# Altium schematic sheet Power.SchDoc
size A; DocumentNumber: 2; SheetNumber: 2; SheetTotal: 5
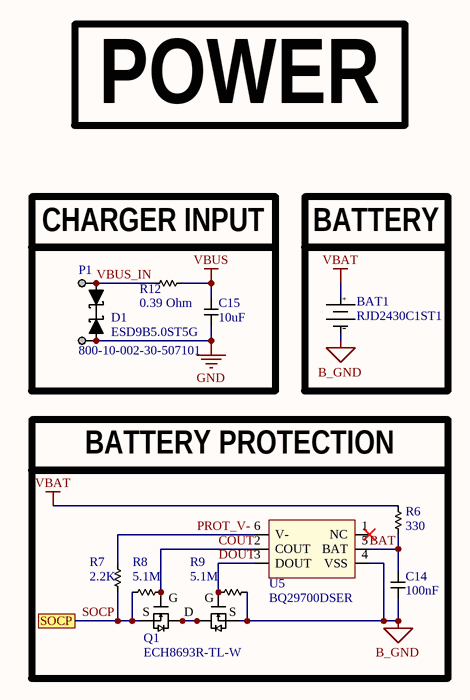
[diagram p0: Power.SchDoc]

## Parts
BAT1  RJD2430C1ST1  [RJD2430C1ST1]
C14  100nF  [CAP_0603_HIGH]
C15  10uF  [CAP_0603_HIGH]
D1  ESD9B5.0ST5G  [ESD9B5.0ST5G]
P1  800-10-002-30-507101  [800-10-002-30-507101]
Q1  ECH8693R-TL-W  [ECH8693R-TL-W]
R6  330  [RES_0603_HIGH]
R7  2.2K  [RES_0603_HIGH]
R8  5.1M  [RES_0603_HIGH]
R9  5.1M  [RES_0603_HIGH]
R12  0.39 Ohm  [RES_0805_HIGH]
U5  BQ29700DSER  [BQ29700DSER]

## Blocks framed on the sheet
CHARGER INPUT: C15 D1 P1 R12
BATTERY: BAT1
BATTERY PROTECTION: C14 Q1 R6-R9 U5

## Ports
SOCP

## Nets
B_GND: BAT1.2(-) C14.2 Q1.3(S2) R9.1 U5.4(VSS)
GND: C15.2 D1.1 P1.2
VBAT: BAT1.1(+) R6.1
VBUS: C15.1 R12.2
BAT: C14.1 R6.2 U5.5(BAT)
COUT: Q1.2(G1) R8.1 U5.2(COUT)
DOUT: Q1.4(G2) R9.2 U5.3(DOUT)
PROT_V-: R7.1 U5.6(V-)
SOCP: Q1.1(S1) R7.2 R8.2 ; port SOCP
VBUS_IN: D1.2 P1.1 R12.1
NetQ1_5: Q1.5(D) Q1.6(D) Q1.7(D) Q1.8(D)

Not connected (* = marked no-connect by the designer): U5 1(NC)*

## Notes on the sheet
- POWER
- (in symbol ECH8693R-TL-W) G; S

## Library data of the parts
BAT1 = RJD2430C1ST1: Coin, 24.5mm 3.7V Lithium-Ion Battery Rechargeable (Secondary) 110mAh
C14 C15 = Capacitor_0603: 0603 Capacitor
D1 = ESD9B5.0ST5G: TVS DIODE 5V SOD923
P1 = 800-10-002-30-507101: 2 Position Spring Mating Target Connector Surface Mount
Q1 = ECH8693R-TL-W: Mosfet Array 2 N-Channel (Dual) Common Drain 24V 14A 1.4W Surface Mount SOT-28FL/ECH8
R6-R9 = Resistor_0603: 0603 Resistor
R12 = Resistor_0805: 0805 Resistor
U5 = BQ29700DSER: Battery Battery Protection IC Lithium-Ion/Polymer 6-WSON (1.5x1.5)